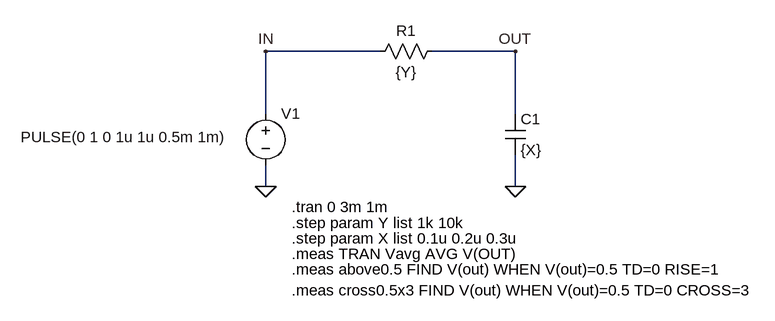
[diagram p0: schematic Measure_Find.asc]
Measure_Find.asc, the LTspice schematic file:
Version 4
SHEET 1 880 680
WIRE -48 0 -224 0
WIRE 160 0 32 0
WIRE -224 96 -224 0
WIRE 160 96 160 0
WIRE -224 208 -224 176
WIRE 160 208 160 160
FLAG -224 208 0
FLAG 160 208 0
FLAG -224 0 IN
FLAG 160 0 OUT
SYMBOL voltage -224 80 R0
WINDOW 3 -377 52 Left 2
WINDOW 123 0 0 Left 0
WINDOW 39 0 0 Left 0
SYMATTR InstName V1
SYMATTR Value PULSE(0 1 0 1u 1u 0.5m 1m)
SYMBOL res 48 -16 R90
WINDOW 0 0 56 VBottom 2
WINDOW 3 32 56 VTop 2
SYMATTR InstName R1
SYMATTR Value {Y}
SYMBOL cap 144 96 R0
SYMATTR InstName C1
SYMATTR Value {X}
TEXT -184 240 Left 2 !.tran 0 3m 1m
TEXT -184 264 Left 2 !.step param Y list 1k 10k
TEXT -184 288 Left 2 !.step param X list 0.1u 0.2u 0.3u
TEXT -184 312 Left 2 !.meas TRAN Vavg AVG V(OUT)
TEXT -184 336 Left 2 !.meas above0.5 FIND V(out) WHEN V(out)=0.5 TD=0 RISE=1
TEXT -184 368 Left 2 !.meas cross0.5x3 FIND V(out) WHEN V(out)=0.5 TD=0 CROSS=3

The netlist it stands for:
* Measure_Find.asc
V1 IN 0 PULSE(0 1 0 1u 1u 0.5m 1m)
R1 OUT IN {Y}
C1 OUT 0 {X}
.tran 0 3m 1m
.step param Y list 1k 10k
.step param X list 0.1u 0.2u 0.3u
.meas TRAN Vavg AVG V(OUT)
.meas above0.5 FIND V(out) WHEN V(out)=0.5 TD=0 RISE=1
.meas cross0.5x3 FIND V(out) WHEN V(out)=0.5 TD=0 CROSS=3
.backanno
.end

* Results of the author's LTspice run, read from the files saved beside the schematic
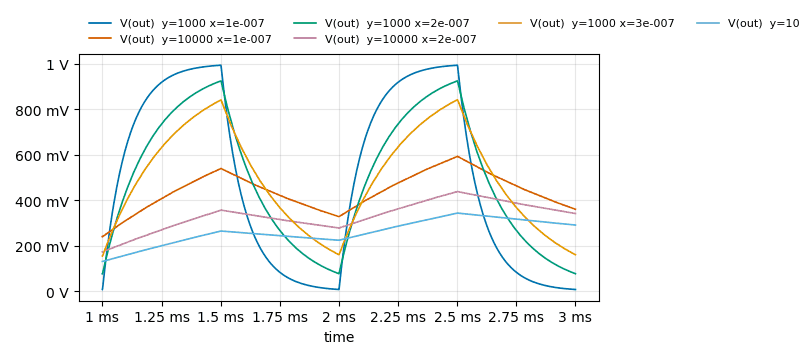
[diagram p1: Transient Analysis of Measure_Find.asc, plotted from the saved traces]
* Transient Analysis, 6 runs:
*   V(out) [y=1000 x=1e-007]: min 6.792 mV, max 993.3 mV, average 501 mV, rms 634.5 mV, last 6.792 mV
*   V(out) [y=10000 x=1e-007]: min 239.4 mV, max 592.2 mV, average 440.8 mV, rms 448.5 mV, last 359.8 mV
*   V(out) [y=1000 x=2e-007]: min 75.94 mV, max 924.4 mV, average 501 mV, rms 576 mV, last 76.46 mV
*   V(out) [y=10000 x=2e-007]: min 172.7 mV, max 437.4 mV, average 332.7 mV, rms 338.9 mV, last 341 mV
*   V(out) [y=1000 x=3e-007]: min 154.1 mV, max 841.5 mV, average 500.2 mV, rms 544.1 mV, last 159.8 mV
*   V(out) [y=10000 x=3e-007]: min 130.3 mV, max 342.9 mV, average 260.7 mV, rms 266.6 mV, last 290.5 mV
* From the log:
*   Measurement: vavg
*     step  AVG(v(out))  FROM  TO
*        1  0.501032  0  0.002
*        2  0.440786  0  0.002
*        3  0.501014  0  0.002
*        4  0.332725  0  0.002
*        5  0.500225  0  0.002
*        6  0.260724  0  0.002
*   Measurement: above0.5
*     step  v(out)  at
*        1  0.5  6.92763e-005
*        2  0.5  0.000420858
*        3  0.5  0.000123774
*        4  0  0
*        5  0.5  0.000159037
*        6  0  0
*   Measurement: cross0.5x3
*     step  v(out)  at
*        1  0.5  0.00106932
*        2  0.5  0.0012997
*        3  0.5  0.00112367
*        4  0  0
*        5  0.5  0.00115708
*        6  0  0